# Altium project Alhambra_II.PrjPcb
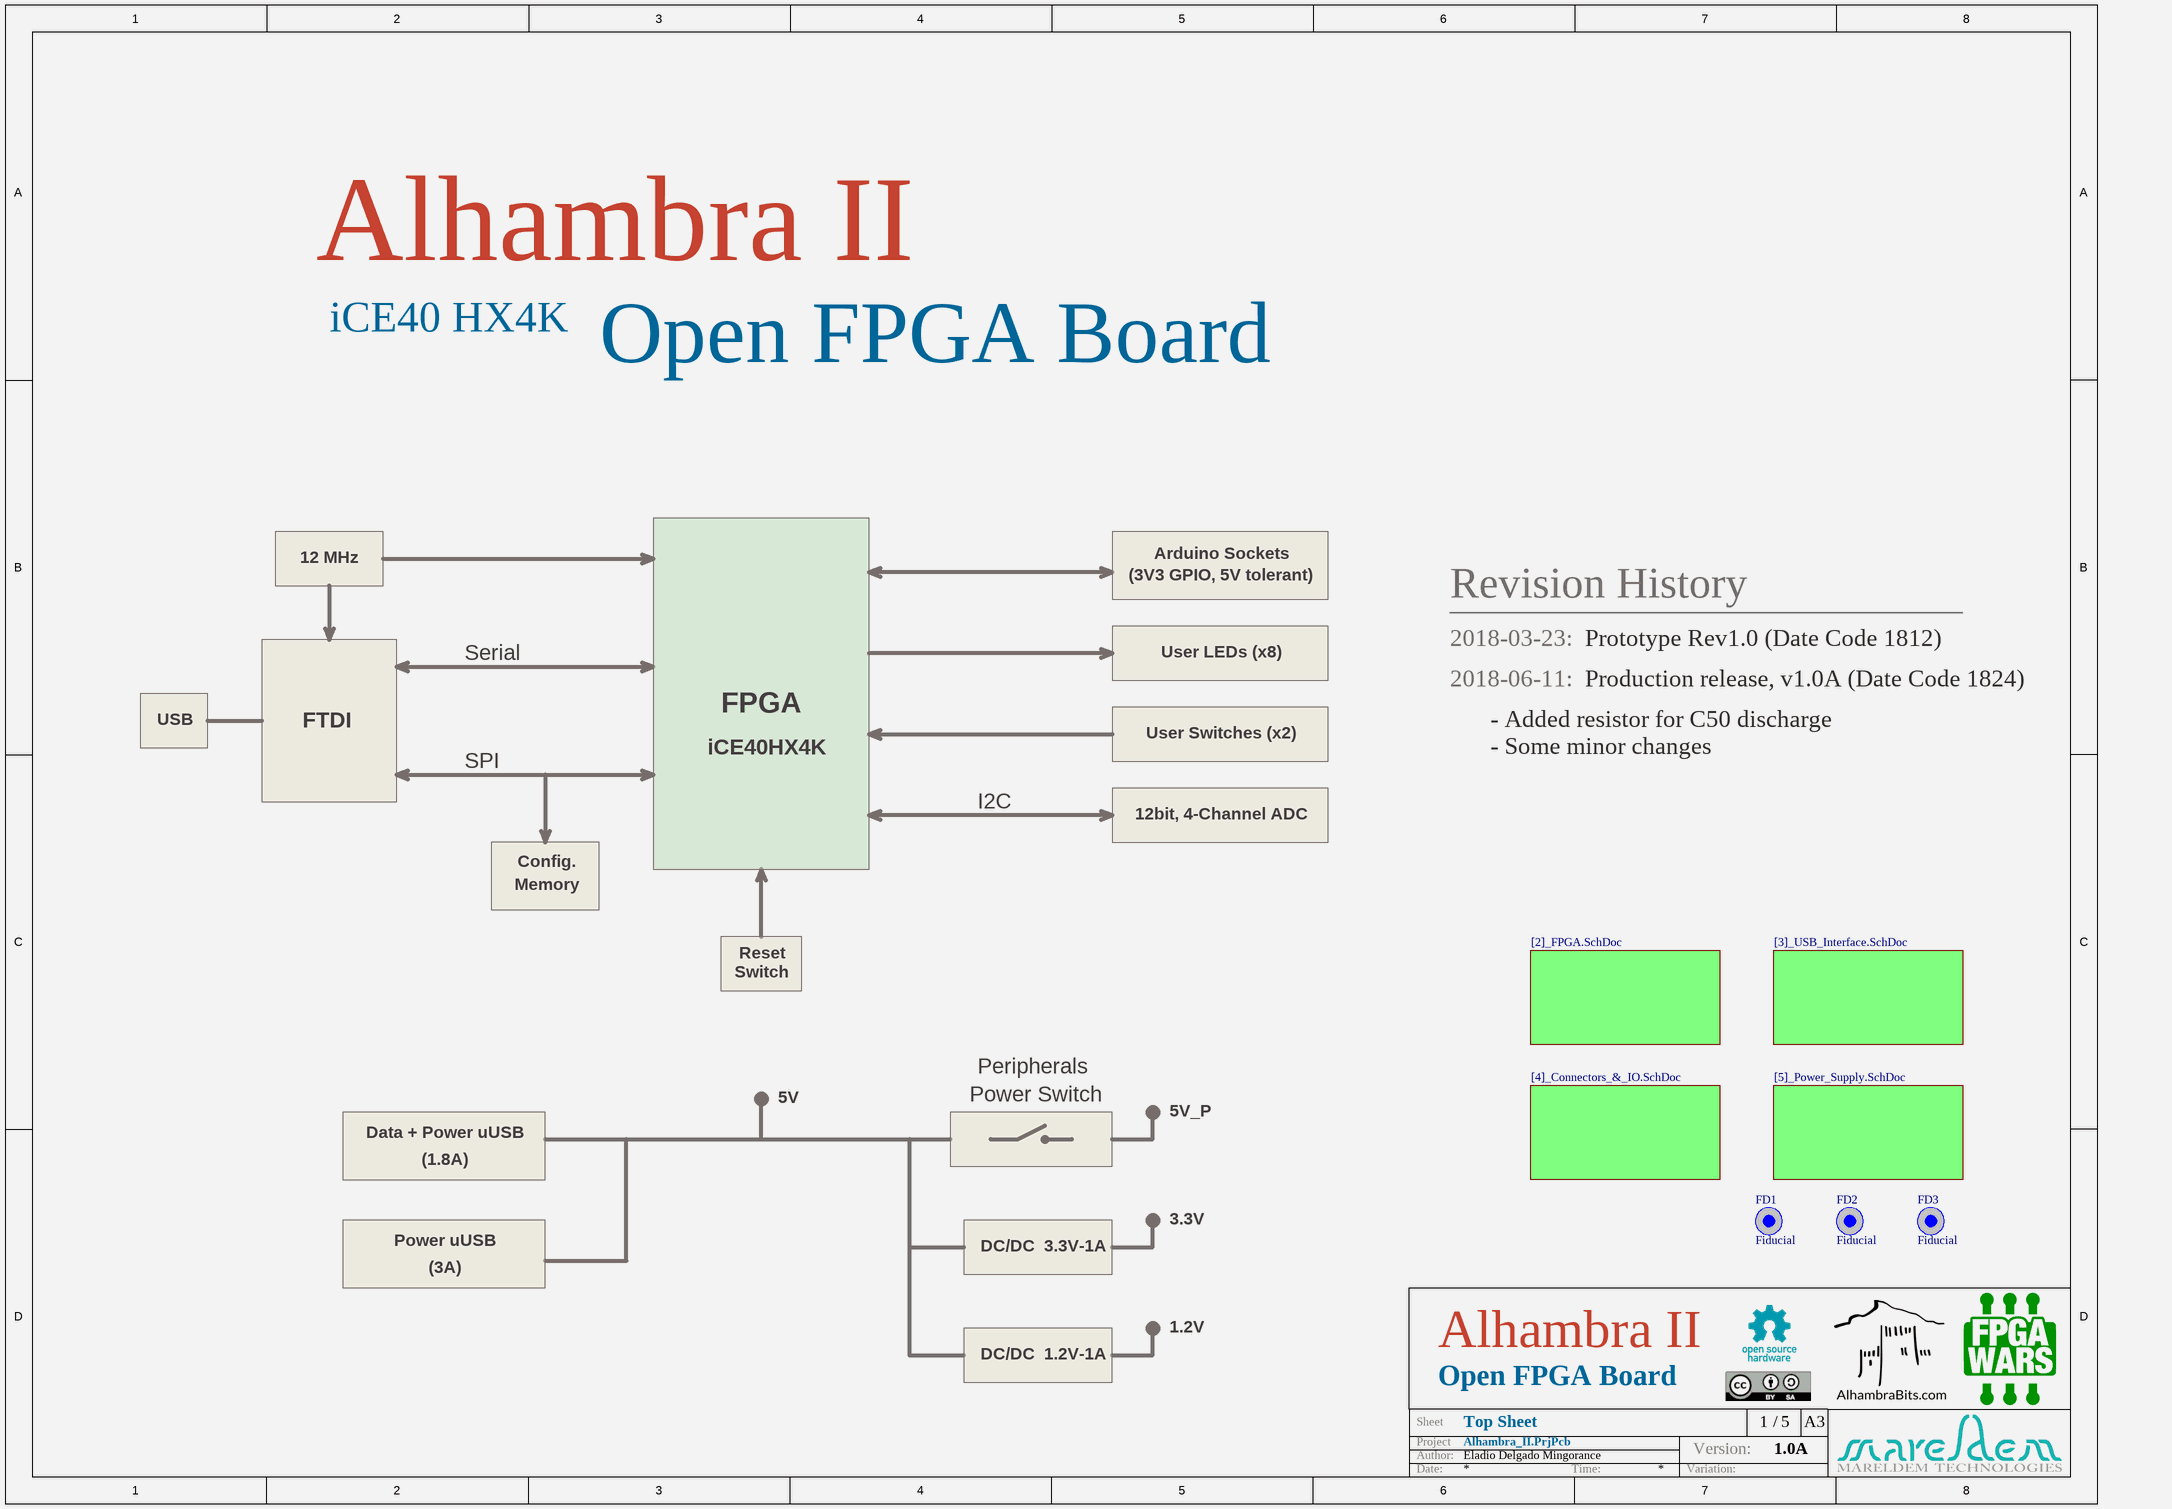
[diagram p0: [1]_Alhambra_II.SchDoc]
3 sheets, 74 parts. Net scope: flat (ports and power ports of the same name join across sheets).
Board files: Alhambra_PLEXYLAB_Rev.PcbDoc, Alhambra_PLEXYLAB_Rev - copia.PcbDoc
Sheets:
  [1]_Alhambra_II.SchDoc
    [2]_FPGA.SchDoc = [2]_FPGA.SchDoc
    [3]_USB_Interface.SchDoc = [3]_USB_Interface.SchDoc

## Sheet [1]_Alhambra_II.SchDoc: Top Sheet
size A3; Author: Eladio Delgado Mingorance; CompanyName: Mareldem Technologies; Organization: Mareldem Technologies; Revision: 1.0A; SheetNumber: 1; SheetTotal: 5

### Parts
FD1  Fiducial  [Fiducial_1mm]  (no BOM)
FD2  Fiducial  [Fiducial_1mm]  (no BOM)
FD3  Fiducial  [Fiducial_1mm]  (no BOM)

### Sub-sheets
[2]_FPGA.SchDoc = [2]_FPGA.SchDoc: no entries
[3]_USB_Interface.SchDoc = [3]_USB_Interface.SchDoc: no entries
[4]_Connectors_&_IO.SchDoc = [4]_Connectors_&_IO.SchDoc (file not in this document): no entries
[5]_Power_Supply.SchDoc = [5]_Power_Supply.SchDoc (file not in this document): no entries

### Notes on the sheet
- Alhambra II
- iCE40 HX4K
- Open FPGA Board
- 12 MHz
- (3V3 GPIO, 5V tolerant)
- Arduino Sockets
- Revision History
- 2018-03-23:
- Prototype Rev1.0 (Date Code 1812)
- Serial
- FPGA
- User LEDs (x8)
- 2018-06-11:
- Production release, v1.0A (Date Code 1824)
- USB
- FTDI
- SPI
- iCE40HX4K
- User Switches (x2)
- - Added resistor for C50 discharge
- - Some minor changes
- I2C
- 12bit, 4-Channel ADC
- Memory
- Config.
- Switch
- Reset
- 5V
- Power Switch
- Peripherals
- 5V_P
- Data + Power uUSB
- (1.8A)
- Power uUSB
- DC/DC  3.3V-1A
- 3.3V
- (3A)
- DC/DC  1.2V-1A
- 1.2V
- Project
- Sheet
- Author:
- Version:
- /
- A3
- Date:
- Time:
- Variation:

### Library data of the parts
FD1-FD3 = Fiducial 1mm: Fiducial Mark; Part Number: Fiducial 1mm

## Sheet [2]_FPGA.SchDoc: FPGA
size A3; Author: Eladio Delgado Mingorance; CompanyName: Mareldem Technologies; Organization: Mareldem Technologies; Revision: 1.0A; SheetNumber: 2; SheetTotal: 5
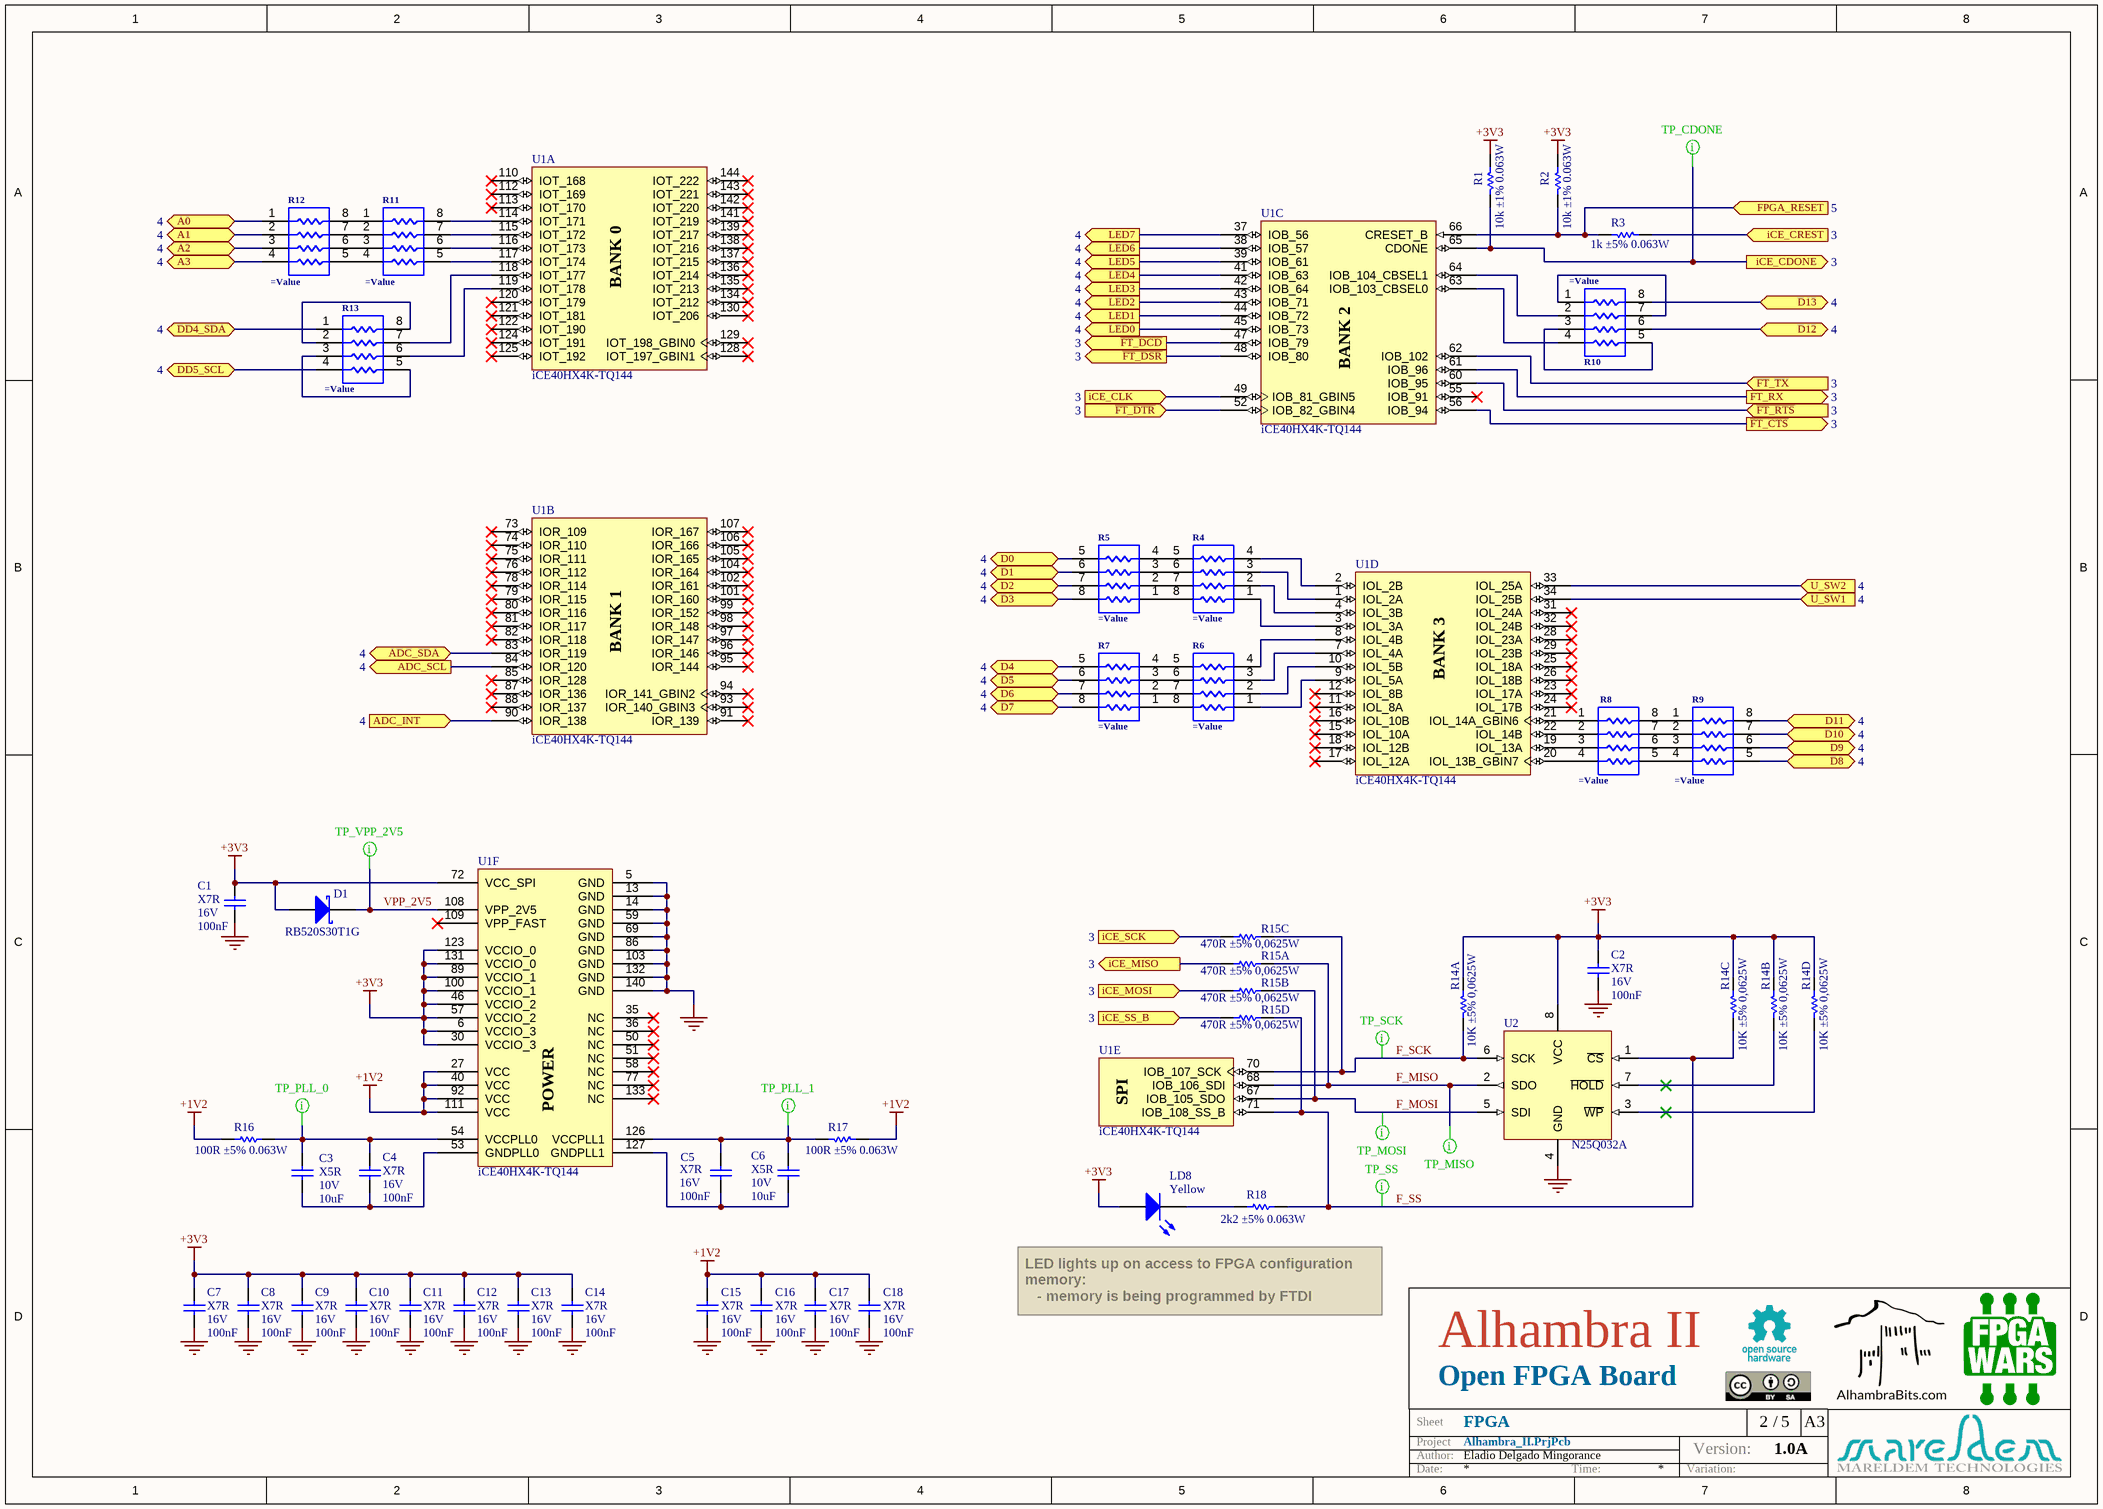
[diagram p1: [2]_FPGA.SchDoc]

### Parts
C1  Dielectric: X7R  Voltage: 16V  Capacitance: 100nF  [C0402]  (hidden comment: Capacitor)
C2  Dielectric: X7R  Voltage: 16V  Capacitance: 100nF  [C0402]  (hidden comment: Capacitor)
C3  Dielectric: X5R  Voltage: 10V  Capacitance: 10uF  [C0603]  (hidden comment: Capacitor)
C4  Dielectric: X7R  Voltage: 16V  Capacitance: 100nF  [C0402]  (hidden comment: Capacitor)
C5  Dielectric: X7R  Voltage: 16V  Capacitance: 100nF  [C0402]  (hidden comment: Capacitor)
C6  Dielectric: X5R  Voltage: 10V  Capacitance: 10uF  [C0603]  (hidden comment: Capacitor)
C7  Dielectric: X7R  Voltage: 16V  Capacitance: 100nF  [C0402]  (hidden comment: Capacitor)
C8  Dielectric: X7R  Voltage: 16V  Capacitance: 100nF  [C0402]  (hidden comment: Capacitor)
C9  Dielectric: X7R  Voltage: 16V  Capacitance: 100nF  [C0402]  (hidden comment: Capacitor)
C10  Dielectric: X7R  Voltage: 16V  Capacitance: 100nF  [C0402]  (hidden comment: Capacitor)
C11  Dielectric: X7R  Voltage: 16V  Capacitance: 100nF  [C0402]  (hidden comment: Capacitor)
C12  Dielectric: X7R  Voltage: 16V  Capacitance: 100nF  [C0402]  (hidden comment: Capacitor)
C13  Dielectric: X7R  Voltage: 16V  Capacitance: 100nF  [C0402]  (hidden comment: Capacitor)
C14  Dielectric: X7R  Voltage: 16V  Capacitance: 100nF  [C0402]  (hidden comment: Capacitor)
C15  Dielectric: X7R  Voltage: 16V  Capacitance: 100nF  [C0402]  (hidden comment: Capacitor)
C16  Dielectric: X7R  Voltage: 16V  Capacitance: 100nF  [C0402]  (hidden comment: Capacitor)
C17  Dielectric: X7R  Voltage: 16V  Capacitance: 100nF  [C0402]  (hidden comment: Capacitor)
C18  Dielectric: X7R  Voltage: 16V  Capacitance: 100nF  [C0402]  (hidden comment: Capacitor)
D1  RB520S30T1G  [SOD523]
LD8  Yellow  [LED0603]
R1  value 10k ±1% 0.063W  [R0402]  (hidden comment: Resistor)
R2  value 10k ±1% 0.063W  [R0402]  (hidden comment: Resistor)
R3  value 1k ±5% 0.063W  [R0402]  (hidden comment: Resistor)
R4  (no value)  [4xArray_1206_Convex]
R5  (no value)  [4xArray_1206_Convex]
R6  (no value)  [4xArray_1206_Convex]
R7  (no value)  [4xArray_1206_Convex]
R8  (no value)  [4xArray_1206_Convex]
R9  (no value)  [4xArray_1206_Convex]
R10  (no value)  [4xArray_1206_Convex]
R11  (no value)  [4xArray_1206_Convex]
R12  (no value)  [4xArray_1206_Convex]
R13  (no value)  [4xArray_1206_Convex]
R14  value 10K ±5% 0,0625W  [4xArray_1206_Convex]  (hidden comment: Resistor_x4_Parts)  (parts A,B,C,D of 4)
R15  value 470R ±5% 0,0625W  [4xArray_1206_Convex]  (hidden comment: Resistor_x4_Parts)  (parts A,B,C,D of 4)
R16  value 100R ±5% 0.063W  [R0402]  (hidden comment: Resistor)
R17  value 100R ±5% 0.063W  [R0402]  (hidden comment: Resistor)
R18  value 2k2 ±5% 0.063W  [R0402]  (hidden comment: Resistor)
U1  iCE40HX4K-TQ144  [TQFP-144_HX4K_FPGAwars]  (parts A,B,C,D,E,F of 6)
U2  N25Q032A  [DFN-8 6x5mm]

### Ports
A0 (bidir, see 4), A1 (bidir, see 4), A2 (bidir, see 4), A3 (bidir, see 4), ADC_INT (in, see 4), ADC_SCL (out, see 4), ADC_SDA (bidir, see 4), D0 (bidir, see 4), D1 (bidir, see 4), D2 (bidir, see 4), D3 (bidir, see 4), D4 (bidir, see 4), D5 (bidir, see 4), D6 (bidir, see 4), D7 (bidir, see 4), D8 (bidir, see 4), D9 (bidir, see 4), D10 (bidir, see 4), D11 (bidir, see 4), D12 (bidir, see 4), D13 (bidir, see 4), DD4_SDA (bidir, see 4), DD5_SCL (bidir, see 4), FPGA_RESET (in, see 5), FT_RX (out, see 3), FT_TX (in, see 3), iCE_CDONE (out, see 3), iCE_CLK (in, see 3), iCE_CREST (in, see 3), iCE_MISO (out, see 3), iCE_MOSI (in, see 3), iCE_SCK (in, see 3), iCE_SS_B (in, see 3), LED0 (out, see 4), LED1 (out, see 4), LED2 (out, see 4), LED3 (out, see 4), LED4 (out, see 4), LED5 (out, see 4), LED6 (out, see 4), LED7 (out, see 4), U_SW1 (in, see 4), U_SW2 (in, see 4), ~{FT_CTS} (out, see 3), ~{FT_DCD} (out, see 3), ~{FT_DSR} (out, see 3), ~{FT_DTR} (in, see 3), ~{FT_RTS} (in, see 3)

### Nets
+1V2: C15.2 C16.2 C17.2 C18.2 R16.2 R17.2 U1.27(VCC) U1.40(VCC) U1.92(VCC) U1.111(VCC)
+3V3: C1.2 C2.1 C7.2 C8.2 C9.2 C10.2 C11.2 C12.2 C13.2 C14.2 D1.A LD8.A R1.1 R2.1 R14.1 R14.2 R14.3 R14.4 U1.6(VCCIO_3) U1.30(VCCIO_3) U1.46(VCCIO_2) U1.57(VCCIO_2) U1.72(VCC_SPI) U1.89(VCCIO_1) U1.100(VCCIO_1) U1.123(VCCIO_0) U1.131(VCCIO_0) U2.8(VCC)
GND: C1.1 C2.2 C7.1 C8.1 C9.1 C10.1 C11.1 C12.1 C13.1 C14.1 C15.1 C16.1 C17.1 C18.1 U1.5(GND) U1.13(GND) U1.14(GND) U1.59(GND) U1.69(GND) U1.86(GND) U1.103(GND) U1.132(GND) U1.140(GND) U2.4(GND)
F_MISO: R15.8 U1.68(IOB_106_SDI) U2.2(SDO)
F_MOSI: R15.7 U1.67(IOB_105_SDO) U2.5(SDI)
F_SCK: R14.8 R15.6 U1.70(IOB_107_SCK) U2.6(SCK)
F_SS: R14.6 R15.5 R18.2 U1.71(IOB_108_SS_B) U2.1(~{CS})
VPP_2V5: D1.k(K) U1.108(VPP_2V5)
NetC3_1: C3.1 C4.2 R16.1 U1.54(VCCPLL0)
NetC3_2: C3.2 C4.1 U1.53(GNDPLL0)
NetC5_1: C5.1 C6.1 U1.127(GNDPLL1)
NetC5_2: C5.2 C6.2 R17.1 U1.126(VCCPLL1)
NetLD8_K: LD8.K R18.1
NetR1_2: R1.2 U1.65(CDONE) ; port iCE_CDONE
NetR2_2: R2.2 R3.2 U1.66(CRESET_B) ; port FPGA_RESET
NetR3_1: R3.1 ; port iCE_CREST
NetR4_1: R4.1 U1.3(IOL_3A)
NetR4_2: R4.2 U1.4(IOL_3B)
NetR4_3: R4.3 U1.1(IOL_2A)
NetR4_4: R4.4 U1.2(IOL_2B)
NetR4_5: R4.5 R5.4
NetR4_6: R4.6 R5.3
NetR4_7: R4.7 R5.2
NetR4_8: R4.8 R5.1
NetR5_5: R5.5 ; port D0
NetR5_6: R5.6 ; port D1
NetR5_7: R5.7 ; port D2
NetR5_8: R5.8 ; port D3
NetR6_1: R6.1 U1.9(IOL_5A)
NetR6_2: R6.2 U1.10(IOL_5B)
NetR6_3: R6.3 U1.7(IOL_4A)
NetR6_4: R6.4 U1.8(IOL_4B)
NetR6_5: R6.5 R7.4
NetR6_6: R6.6 R7.3
NetR6_7: R6.7 R7.2
NetR6_8: R6.8 R7.1
NetR7_5: R7.5 ; port D4
NetR7_6: R7.6 ; port D5
NetR7_7: R7.7 ; port D6
NetR7_8: R7.8 ; port D7
NetR8_1: R8.1 U1.21(IOL_14A_GBIN6)
NetR8_2: R8.2 U1.22(IOL_14B)
NetR8_3: R8.3 U1.19(IOL_13A)
NetR8_4: R8.4 U1.20(IOL_13B_GBIN7)
NetR8_5: R8.5 R9.4
NetR8_6: R8.6 R9.3
NetR8_7: R8.7 R9.2
NetR8_8: R8.8 R9.1
NetR9_5: R9.5 ; port D8
NetR9_6: R9.6 ; port D9
NetR9_7: R9.7 ; port D10
NetR9_8: R9.8 ; port D11
NetR10_1: R10.1 R10.7
NetR10_2: R10.2 U1.64(IOB_104_CBSEL1)
NetR10_3: R10.3 R10.5
NetR10_4: R10.4 U1.63(IOB_103_CBSEL0)
NetR10_6: R10.6 ; port D12
NetR10_8: R10.8 ; port D13
NetR11_1: R11.1 R12.8
NetR11_2: R11.2 R12.7
NetR11_3: R11.3 R12.6
NetR11_4: R11.4 R12.5
NetR11_5: R11.5 U1.117(IOT_174)
NetR11_6: R11.6 U1.116(IOT_173)
NetR11_7: R11.7 U1.115(IOT_172)
NetR11_8: R11.8 U1.114(IOT_171)
NetR12_1: R12.1 ; port A0
NetR12_2: R12.2 ; port A1
NetR12_3: R12.3 ; port A2
NetR12_4: R12.4 ; port A3
NetR13_1: R13.1 ; port DD4_SDA
NetR13_2: R13.2 R13.8
NetR13_3: R13.3 R13.5
NetR13_4: R13.4 ; port DD5_SCL
NetR13_6: R13.6 U1.119(IOT_178)
NetR13_7: R13.7 U1.118(IOT_177)
NetR14_5: R14.5 U2.3(~{WP})
NetR14_7: R14.7 U2.7(~{HOLD})
NetR15_1: R15.1 ; port iCE_MISO
NetR15_2: R15.2 ; port iCE_MOSI
NetR15_3: R15.3 ; port iCE_SCK
NetR15_4: R15.4 ; port iCE_SS_B
NetR27_2: U1.49(IOB_81_GBIN5) ; port iCE_CLK
NetU1_33: U1.33(IOL_25A) ; port U_SW2
NetU1_34: U1.34(IOL_25B) ; port U_SW1
NetU1_37: U1.37(IOB_56) ; port LED7
NetU1_38: U1.38(IOB_57) ; port LED6
NetU1_39: U1.39(IOB_61) ; port LED5
NetU1_41: U1.41(IOB_63) ; port LED4
NetU1_42: U1.42(IOB_64) ; port LED3
NetU1_43: U1.43(IOB_71) ; port LED2
NetU1_44: U1.44(IOB_72) ; port LED1
NetU1_45: U1.45(IOB_73) ; port LED0
NetU1_47: U1.47(IOB_79) ; port ~{FT_DCD}
NetU1_48: U1.48(IOB_80) ; port ~{FT_DSR}
NetU1_52: U1.52(IOB_82_GBIN4) ; port ~{FT_DTR}
NetU1_56: U1.56(IOB_94) ; port ~{FT_CTS}
NetU1_60: U1.60(IOB_95) ; port ~{FT_RTS}
NetU1_61: U1.61(IOB_96) ; port FT_RX
NetU1_62: U1.62(IOB_102) ; port FT_TX
NetU1_83: U1.83(IOR_119) ; port ADC_SDA
NetU1_84: U1.84(IOR_120) ; port ADC_SCL
NetU1_90: U1.90(IOR_138) ; port ADC_INT

Not connected (* = marked no-connect by the designer): U1 11(IOL_8A)* 12(IOL_8B)* 15(IOL_10A)* 16(IOL_10B)* 17(IOL_12A)* 18(IOL_12B)* 23(IOL_17A)* 24(IOL_17B)* 25(IOL_18A)* 26(IOL_18B)* 28(IOL_23A)* 29(IOL_23B)* 31(IOL_24A)* 32(IOL_24B)* 35(NC)* 36(NC)* 50(NC)* 51(NC)* 55(IOB_91)* 58(NC)* 73(IOR_109)* 74(IOR_110)* 75(IOR_111)* 76(IOR_112)* 77(NC)* 78(IOR_114)* 79(IOR_115)* 80(IOR_116)* 81(IOR_117)* 82(IOR_118)* 85(IOR_128)* 87(IOR_136)* 88(IOR_137)* 91(IOR_139)* 93(IOR_140_GBIN3)* 94(IOR_141_GBIN2)* 95(IOR_144)* 96(IOR_146)* 97(IOR_147)* 98(IOR_148)* 99(IOR_152)* 101(IOR_160)* 102(IOR_161)* 104(IOR_164)* 105(IOR_165)* 106(IOR_166)* 107(IOR_167)* 109(VPP_FAST)* 110(IOT_168)* 112(IOT_169)* 113(IOT_170)* 120(IOT_179)* 121(IOT_181)* 122(IOT_190)* 124(IOT_191)* 125(IOT_192)* 128(IOT_197_GBIN1)* 129(IOT_198_GBIN0)* 130(IOT_206)* 133(NC)* 134(IOT_212)* 135(IOT_213)* 136(IOT_214)* 137(IOT_215)* 138(IOT_216)* 139(IOT_217)* 141(IOT_219)* 142(IOT_220)* 143(IOT_221)* 144(IOT_222)*

### Layout directives
net class Test Points: F_MISO, F_MOSI, F_SCK, F_SS, NetC3_1, NetC5_2, NetR1_2, VPP_2V5

### Notes on the sheet
- LED lights up on access to FPGA configuration memory:
  - memory is being programmed by FTDI
  - memory is being read by FPGA after reset or power-on
- Alhambra II
- Open FPGA Board
- Project
- Sheet
- Author:
- Version:
- /
- A3
- Date:
- Time:
- Variation:
- (in symbol iCE40-HX4K, part A) BANK 0
- (in symbol iCE40-HX4K, part B) BANK 1
- (in symbol iCE40-HX4K, part C) BANK 2
- (in symbol iCE40-HX4K, part D) BANK 3
- (in symbol iCE40-HX4K, part E) SPI
- (in symbol iCE40-HX4K, part F) POWER

### Library data of the parts
C1 C2 C4 C5 C7-C18 = C0402_100nF_16V_±10%: Capacitor SMD; Manufacturer: Kemet; Value: 100nF ±10% 16V; Tolerance: ±10%; OrderingCode: C0402C104K4RAC; Temp_ Max: 125; Temp_ Min: -55; Part Number: C0402_100nF_16V_±10%; Price (€): 0,05
C3 C6 = C0603_10uF_10V_±10%: Capacitor SMD; Manufacturer: Murata; Value: 10uF ±10% 10V; Tolerance: ±10%; OrderingCode: GRM188R61A106KE69D; Temp_ Max: 85; Temp_ Min: -55; Part Number: C0603_10uF_10V_±10%; Price (€): 0,027
D1 = RB520S30T1G: Schottky Diode; Manufacturer: On Semiconductor; Ifor: 200mA; Vrrm: 30V; Ifsm: 300mA; Vf: 0,35V; Temp_ Max: 150; Temp_ Min: -55; Value: 200mA 30V; Part Number: RB520S30T1G; OrderingCode: RB520S30T1G; Price (€): 0,017
LD8 = LED Yellow 0603 Wurth: LED; Manufacturer: WE; OrderingCode: 150 060 YS7 5000; Temp_ Max: 85; Temp_ Min: -40; Part Number: LED Yellow 0603 Wurth; Price (€): 0,07; Value: Yellow
R1 R2 = R0402_10k_0.063W_±1%: Resistor, SMD; Manufacturer: Vishay; Tolerance: ±1%; OrderingCode: CRCW040210K0FK; Power: 0.063W; Resistance: 10k; Temp_ Max: 155; Temp_ Min: -55; PackageDescription: SMD; Part Number: R0402_10k_0.063W_±1%; Price (€): 0,006
R3 = R0402_1k_0.063W_±5%: Resistor, SMD; Manufacturer: Vishay; Tolerance: ±5%; OrderingCode: CRCW04021K00JN; Power: 0.063W; Resistance: 1k; Temp_ Max: 155; Temp_ Min: -55; PackageDescription: SMD; Part Number: R0402_1k_0.063W_±5%; Price (€): 0,003
R4-R13 = 4xArray_1206_Convex_100R_0,0625W_0,05: Resistor, Array 4x1; Manufacturer: Yageo; Resistance: 100R; Tolerance: 5%; OrderingCode: YC164-JR-07100RL; Temp_ Max: 155; Temp_ Min: -25; Value: 100R 5% 0,0625W; Part Number: 4xArray_1206_Convex_100R_0,0625W_0,05; Power: 0,0625W; Price (€): 0,005
R14 = 4xArray_1206_Convex_10K_0,0625W_±5%: Resistor; Manufacturer: Yageo; Tolerance: ±5%; OrderingCode: YC164-JR-0710KL; Resistance: 10K; Temp_ Max: 155; Temp_ Min: -55; PackageDescription: SMD; Power: 0,0625W; Part Number: 4xArray_1206_Convex_10K_0,0625W_±5%; Price (€): 0,006
R15 = 4xArray_1206_Convex_470R_0,0625W_±5%: Resistor; Manufacturer: Yageo; Tolerance: ±5%; OrderingCode: YC164-JR-07470RL; Resistance: 470R; Temp_ Max: 155; Temp_ Min: -25; PackageDescription: SMD; Power: 0,0625W; Part Number: 4xArray_1206_Convex_470R_0,0625W_±5%; Price (€): 0,006
R16 R17 = R0402_100R_0.063W_±5%: Resistor, SMD; Manufacturer: Vishay; Tolerance: ±5%; OrderingCode: CRCW0402100RJN; Power: 0.063W; Resistance: 100R; Temp_ Max: 155; Temp_ Min: -55; PackageDescription: SMD; Part Number: R0402_100R_0.063W_±5%; Price (€): 0,003
R18 = R0402_2k2_0.063W_±5%: Resistor, SMD; Manufacturer: Vishay; Tolerance: ±5%; OrderingCode: CRCW04022K20JN; Power: 0.063W; Resistance: 2k2; Temp_ Max: 155; Temp_ Min: -55; PackageDescription: SMD; Part Number: R0402_2k2_0.063W_±5%; Price (€): 0,003
U1 = iCE40-HX4K: iCE40 HX4K Series FPGA Family, 3520 Logic Cells, 1.2 V Core, 80 K Embedded RAM Bits, 144-pin TQFP, Pb-Free, Tray; Manufacturer: Lattice; Temp_ Max: 85; Temp_ Min: -40; Part Number: iCE40-HX4K; OrderingCode: iCE40HX4K-TQ144; Price (€): 6
U2 = N25Q032A: NOR Flash Memory, serial; Manufacturer: Micron; OrderingCode: N25Q032A13EF640E; Temp_ Max: 85; Temp_ Min: -40; OrderingCode 2: S25FL032P0XNFI011; Value: 32Mb; Part Number: N25Q032A; Supplier: Silica; Price (€): 0,9; Manufacturer 2: Spansion

## Sheet [3]_USB_Interface.SchDoc: USB Interface
size A3; Author: Eladio Delgado Mingorance; CompanyName: Mareldem Technologies; Organization: Mareldem Technologies; Revision: 1.0A; SheetNumber: 3; SheetTotal: 5
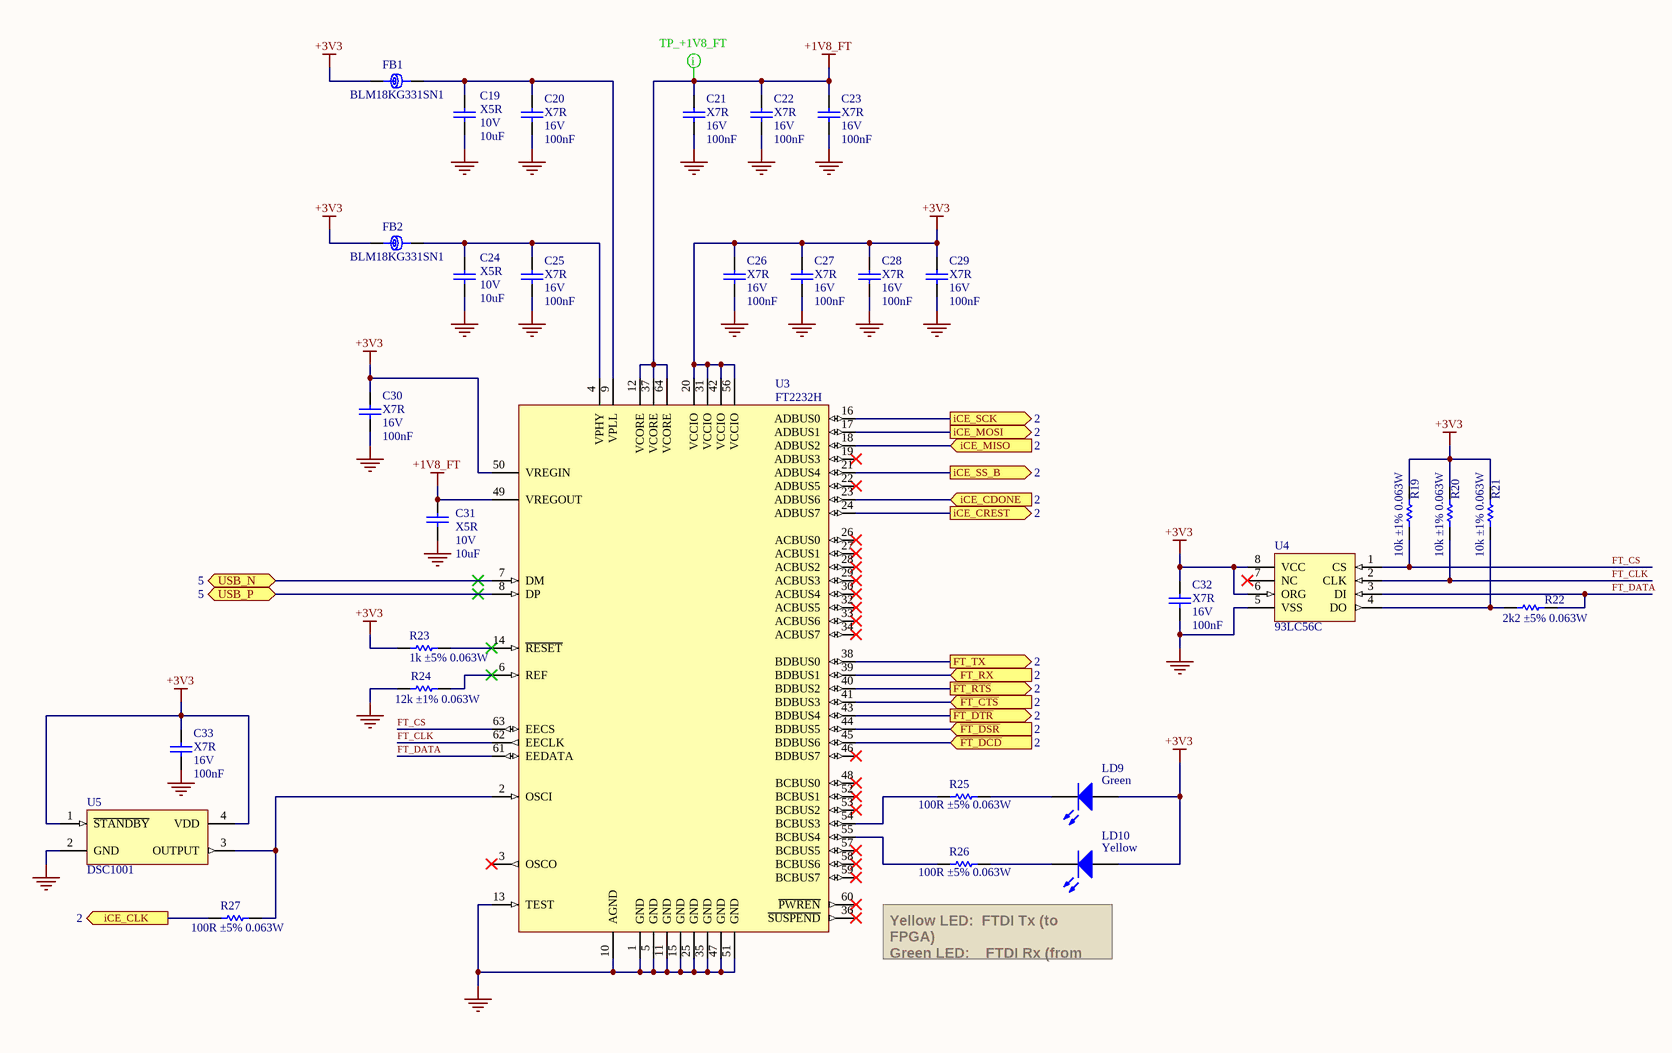
[diagram p2: [3]_USB_Interface.SchDoc]

### Parts
C19  Dielectric: X5R  Voltage: 10V  Capacitance: 10uF  [C0603]  (hidden comment: Capacitor)
C20  Dielectric: X7R  Voltage: 16V  Capacitance: 100nF  [C0402]  (hidden comment: Capacitor)
C21  Dielectric: X7R  Voltage: 16V  Capacitance: 100nF  [C0402]  (hidden comment: Capacitor)
C22  Dielectric: X7R  Voltage: 16V  Capacitance: 100nF  [C0402]  (hidden comment: Capacitor)
C23  Dielectric: X7R  Voltage: 16V  Capacitance: 100nF  [C0402]  (hidden comment: Capacitor)
C24  Dielectric: X5R  Voltage: 10V  Capacitance: 10uF  [C0603]  (hidden comment: Capacitor)
C25  Dielectric: X7R  Voltage: 16V  Capacitance: 100nF  [C0402]  (hidden comment: Capacitor)
C26  Dielectric: X7R  Voltage: 16V  Capacitance: 100nF  [C0402]  (hidden comment: Capacitor)
C27  Dielectric: X7R  Voltage: 16V  Capacitance: 100nF  [C0402]  (hidden comment: Capacitor)
C28  Dielectric: X7R  Voltage: 16V  Capacitance: 100nF  [C0402]  (hidden comment: Capacitor)
C29  Dielectric: X7R  Voltage: 16V  Capacitance: 100nF  [C0402]  (hidden comment: Capacitor)
C30  Dielectric: X7R  Voltage: 16V  Capacitance: 100nF  [C0402]  (hidden comment: Capacitor)
C31  Dielectric: X5R  Voltage: 10V  Capacitance: 10uF  [C0603]  (hidden comment: Capacitor)
C32  Dielectric: X7R  Voltage: 16V  Capacitance: 100nF  [C0402]  (hidden comment: Capacitor)
C33  Dielectric: X7R  Voltage: 16V  Capacitance: 100nF  [C0402]  (hidden comment: Capacitor)
FB1  BLM18KG331SN1  [L0603]
FB2  BLM18KG331SN1  [L0603]
LD9  Green  [LED0603]
LD10  Yellow  [LED0603]
R19  value 10k ±1% 0.063W  [R0402]  (hidden comment: Resistor)
R20  value 10k ±1% 0.063W  [R0402]  (hidden comment: Resistor)
R21  value 10k ±1% 0.063W  [R0402]  (hidden comment: Resistor)
R22  value 2k2 ±5% 0.063W  [R0402]  (hidden comment: Resistor)
R23  value 1k ±5% 0.063W  [R0402]  (hidden comment: Resistor)
R24  value 12k ±1% 0.063W  [R0402]  (hidden comment: Resistor)
R25  value 100R ±5% 0.063W  [R0402]  (hidden comment: Resistor)
R26  value 100R ±5% 0.063W  [R0402]  (hidden comment: Resistor)
R27  value 100R ±5% 0.063W  [R0402]  (hidden comment: Resistor)
U3  FT2232H  [FTDI_QFN-64]
U4  93LC56C  [MSOP8]
U5  DSC1001  [OSC 3.2x2.5]

### Ports
FT_RX (in, see 2), FT_TX (out, see 2), iCE_CDONE (in, see 2), iCE_CLK (out, see 2), iCE_CREST (out, see 2), iCE_MISO (in, see 2), iCE_MOSI (out, see 2), iCE_SCK (out, see 2), iCE_SS_B (out, see 2), USB_N (bidir, see 5), USB_P (bidir, see 5), ~{FT_CTS} (in, see 2), ~{FT_DCD} (in, see 2), ~{FT_DSR} (in, see 2), ~{FT_DTR} (out, see 2), ~{FT_RTS} (out, see 2)

### Nets
+1V8_FT: C21.2 C22.2 C23.2 C31.2 U3.12(VCORE) U3.37(VCORE) U3.49(VREGOUT) U3.64(VCORE)
+3V3: C26.2 C27.2 C28.2 C29.2 C30.2 C32.2 C33.2 FB1.1 FB2.1 LD9.A LD10.A R19.2 R20.2 R21.2 R23.2 U3.20(VCCIO) U3.31(VCCIO) U3.42(VCCIO) U3.50(VREGIN) U3.56(VCCIO) U4.6(ORG) U4.8(VCC) U5.1(~{STANDBY}) U5.4(VDD)
GND: C19.1 C20.1 C21.1 C22.1 C23.1 C24.1 C25.1 C26.1 C27.1 C28.1 C29.1 C30.1 C31.1 C32.1 C33.1 R24.2 U3.1(GND) U3.5(GND) U3.10(AGND) U3.11(GND) U3.13(TEST) U3.15(GND) U3.25(GND) U3.35(GND) U3.47(GND) U3.51(GND) U4.5(VSS) U5.2(GND)
FT_CLK: R20.1 U3.62(EECLK) U4.2(CLK)
FT_CS: R19.1 U3.63(EECS) U4.1(CS)
FT_DATA: R22.1 U3.61(EEDATA) U4.3(DI)
NetC19_2: C19.2 C20.2 FB1.2 U3.9(VPLL)
NetC24_2: C24.2 C25.2 FB2.2 U3.4(VPHY)
NetLD9_K: LD9.K R25.2
NetLD10_K: LD10.K R26.2
NetR1_2: U3.23(ADBUS6) ; port iCE_CDONE
NetR3_1: U3.24(ADBUS7) ; port iCE_CREST
NetR15_1: U3.18(ADBUS2) ; port iCE_MISO
NetR15_2: U3.17(ADBUS1) ; port iCE_MOSI
NetR15_3: U3.16(ADBUS0) ; port iCE_SCK
NetR15_4: U3.21(ADBUS4) ; port iCE_SS_B
NetR21_1: R21.1 R22.2 U4.4(DO)
NetR23_1: R23.1 U3.14(~{RESET})
NetR24_1: R24.1 U3.6(REF)
NetR25_1: R25.1 U3.54(BCBUS3)
NetR26_1: R26.1 U3.55(BCBUS4)
NetR27_1: R27.1 U3.2(OSCI) U5.3(OUTPUT)
NetR27_2: R27.2 ; port iCE_CLK
NetU1_47: U3.45(BDBUS6) ; port ~{FT_DCD}
NetU1_48: U3.44(BDBUS5) ; port ~{FT_DSR}
NetU1_52: U3.43(BDBUS4) ; port ~{FT_DTR}
NetU1_56: U3.41(BDBUS3) ; port ~{FT_CTS}
NetU1_60: U3.40(BDBUS2) ; port ~{FT_RTS}
NetU1_61: U3.39(BDBUS1) ; port FT_RX
NetU1_62: U3.38(BDBUS0) ; port FT_TX
NetU3_7: U3.7(DM) ; port USB_N
NetU3_8: U3.8(DP) ; port USB_P

Not connected (* = marked no-connect by the designer): U3 3(OSCO)* 19(ADBUS3)* 22(ADBUS5)* 26(ACBUS0)* 27(ACBUS1)* 28(ACBUS2)* 29(ACBUS3)* 30(ACBUS4)* 32(ACBUS5)* 33(ACBUS6)* 34(ACBUS7)* 36(~{SUSPEND})* 46(BDBUS7)* 48(BCBUS0)* 52(BCBUS1)* 53(BCBUS2)* 57(BCBUS5)* 58(BCBUS6)* 59(BCBUS7)* 60(~{PWREN})*; U4 7(NC)*

### Layout directives
net class Test Points: +1V8_FT

### Notes on the sheet
- Yellow LED:  FTDI Tx (to FPGA)
  Green LED:    FTDI Rx (from FPGA)
- Alhambra II
- Open FPGA Board
- Project
- Sheet
- Author:
- Version:
- /
- A3
- Date:
- Time:
- Variation:

### Library data of the parts
C19 C24 C31 = C0603_10uF_10V_±10%: as C3 on sheet [2]_FPGA; Part Number: C0603_10uF_10V_±10%; Price (€): 0,027
C20-C23 C25-C30 C32 C33 = C0402_100nF_16V_±10%: as C1 on sheet [2]_FPGA; Part Number: C0402_100nF_16V_±10%; Price (€): 0,05
FB1 FB2 = L0603_330R_0,080R_1700 mA: Ferrite Bead; Manufacturer: Murata; Resistance_100MHz: 330R; Resistance_DC: 0,080R; Current: 1700 mA; Temp_ Max: 125; Temp_ Min: -55; Value: 330R 0,080R 1700 mA; Part Number: L0603_330R_0,080R_1700 mA; OrderingCode: BLM18KG331SN1; Price (€): 0,021
LD9 = LED Green 0603 Wurth: LED; Manufacturer: WE; OrderingCode: 150 060 VS7 5000; Temp_ Max: 85; Temp_ Min: -40; Part Number: LED Green 0603 Wurth; Price (€): 0,07; Value: Green
LD10 = LED Yellow 0603 Wurth: as LD8 on sheet [2]_FPGA; Part Number: LED Yellow 0603 Wurth; Price (€): 0,07; Value: Yellow
R19-R21 = R0402_10k_0.063W_±1%: as R1 on sheet [2]_FPGA; PackageDescription: SMD; Part Number: R0402_10k_0.063W_±1%; Price (€): 0,006
R22 = R0402_2k2_0.063W_±5%: as R18 on sheet [2]_FPGA; PackageDescription: SMD; Part Number: R0402_2k2_0.063W_±5%; Price (€): 0,003
R23 = R0402_1k_0.063W_±5%: as R3 on sheet [2]_FPGA; PackageDescription: SMD; Part Number: R0402_1k_0.063W_±5%; Price (€): 0,003
R24 = R0402_12k_0.063W_±1%: Resistor, SMD; Manufacturer: Vishay; Tolerance: ±1%; OrderingCode: CRCW040212K0FK; Power: 0.063W; Resistance: 12k; Temp_ Max: 155; Temp_ Min: -55; PackageDescription: SMD; Part Number: R0402_12k_0.063W_±1%; Price (€): 0,006
R25-R27 = R0402_100R_0.063W_±5%: as R16 on sheet [2]_FPGA; PackageDescription: SMD; Part Number: R0402_100R_0.063W_±5%; Price (€): 0,003
U3 = FT2232H: Dual High Speed USB to Multipurpose UART/FIFO IC; Manufacturer: FTDI; OrderingCode: FT2232HQ-REEL; Temp_ Max: 85; Temp_ Min: -40; Part Number: FT2232H; Supplier: Silica; Price (€): 3,45
U4 = 93LC56C: EEPROM, 2K Microwire Compatible Serial, 8 or 16 bit word size, 2.5-5.5 Vcc range; Manufacturer: Microchip; OrderingCode: 93LC56CT-I/MS; Temp_ Max: 85; Temp_ Min: -40; Value: 2Kb; Part Number: 93LC56C; Supplier: Silica; Price (€): 0,24
U5 = DSC1001-12MHZ: Oscillator, Low-Power CMOS, 4 pin, 1.8-3.3V; Manufacturer: Microchip; OrderingCode: DSC1001CL2-012.0000; Temp_ Max: 105; Temp_ Min: -40; Value: 12MHz; Part Number: DSC1001-12MHZ; Price (€): 0,61

## Nets that join several sheets
+3V3: [2]_FPGA (28 pins), [3]_USB_Interface (24 pins)
GND: [2]_FPGA (24 pins), [3]_USB_Interface (28 pins)
NetR1_2: [2]_FPGA (R1.2 U1.65), [3]_USB_Interface (U3.23)
NetR3_1: [2]_FPGA (R3.1), [3]_USB_Interface (U3.24)
NetR15_1: [2]_FPGA (R15.1), [3]_USB_Interface (U3.18)
NetR15_2: [2]_FPGA (R15.2), [3]_USB_Interface (U3.17)
NetR15_3: [2]_FPGA (R15.3), [3]_USB_Interface (U3.16)
NetR15_4: [2]_FPGA (R15.4), [3]_USB_Interface (U3.21)
NetR27_2: [2]_FPGA (U1.49), [3]_USB_Interface (R27.2)
NetU1_47: [2]_FPGA (U1.47), [3]_USB_Interface (U3.45)
NetU1_48: [2]_FPGA (U1.48), [3]_USB_Interface (U3.44)
NetU1_52: [2]_FPGA (U1.52), [3]_USB_Interface (U3.43)
NetU1_56: [2]_FPGA (U1.56), [3]_USB_Interface (U3.41)
NetU1_60: [2]_FPGA (U1.60), [3]_USB_Interface (U3.40)
NetU1_61: [2]_FPGA (U1.61), [3]_USB_Interface (U3.39)
NetU1_62: [2]_FPGA (U1.62), [3]_USB_Interface (U3.38)